# Altium project HeatPress.PrjPcb
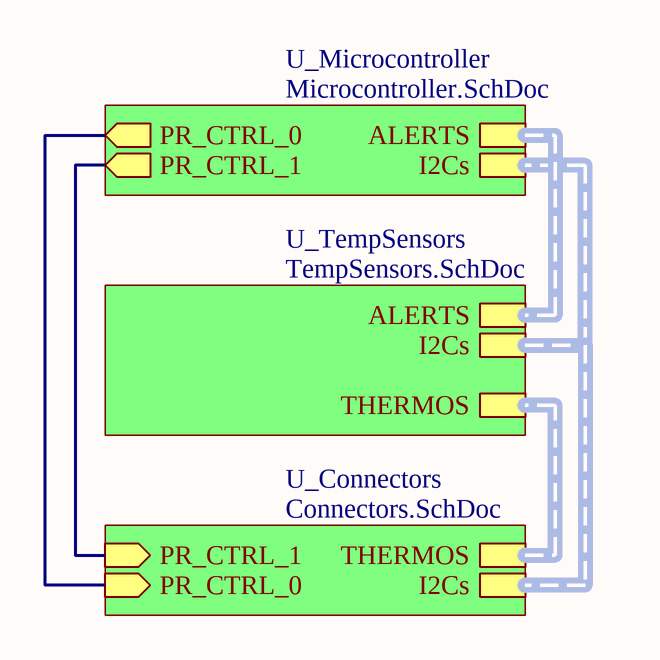
[diagram p0: MainBoard.SchDoc]
CAGE_CODE: ?????; CONTRACT_NUMBER: <CONTRACT NO>; DOC_NO_ASSY_DWG: <ASSY DWG NO>; DOC_NO_BOM: <BOM DOC NO>; DOC_NO_FAB_DWG: <FAB DWG NO>; DOC_NO_SCH_DWG: <SCH DWG NO>; PCB_2_DEC_TOL: +/-.01; PCB_3_DEC_TOL: +/-.010; PCB_ANG_TOL: +/-1/2; PCB_ASSEMBLY_NO: <PCB ASSY NO>; PCB_CHECKER: - -----; PCB_CHECKER_APP_DATE: --/--/----; PCB_DESIGNER: - -----; PCB_DESIGNER_APP_DATE: --/--/----; PCB_DWG_NO: <PCB DWG NO>; PCB_ENGINEER: - -----; PCB_ENGINEER_APP_DATE: --/--/----; PCB_PART_NUMBER: <PCB PN>; PCB_REV: A; SCH_REV: A
7 sheets, 147 parts. Net scope: hierarchical (ports join the sheet entries above them; power ports are global).
Board file: Main.PcbDoc
Sheets:
  MainBoard.SchDoc
    U_Microcontroller = Microcontroller.SchDoc
    U_TempSensors = TempSensors.SchDoc
      TS1 = TempSensor.SchDoc
      TS2 = TempSensor.SchDoc
      TS3 = TempSensor.SchDoc
      TS4 = TempSensor.SchDoc
    U_Connectors = Connectors.SchDoc
  HeatPlates.SchDoc
  Ext_Components.SchDoc

## Sheet MainBoard.SchDoc
size A; SheetNumber: 1; SheetTotal: 7

### Sub-sheets
U_Connectors = Connectors.SchDoc: THERMOS (harness THERMOS), PR_CTRL_0 (in), I2Cs (harness I2C_M), PR_CTRL_1 (in)
U_Microcontroller = Microcontroller.SchDoc: I2Cs (harness I2C_M), ALERTS (harness ALERT), PR_CTRL_0 (out), PR_CTRL_1 (out)
U_TempSensors = TempSensors.SchDoc: I2Cs (harness I2C_M), ALERTS (harness ALERT), THERMOS (harness ALERT)

### Nets
PR_CTRL_0: sheet U_Microcontroller/PR_CTRL_0, sheet U_Connectors/PR_CTRL_0
PR_CTRL_1: sheet U_Microcontroller/PR_CTRL_1, sheet U_Connectors/PR_CTRL_1

### Buses and harness runs
harness sheet U_Connectors/I2Cs = sheet U_Microcontroller/I2Cs = sheet U_TempSensors/I2Cs
harness sheet U_Connectors/THERMOS = sheet U_TempSensors/THERMOS
harness sheet U_Microcontroller/ALERTS = sheet U_TempSensors/ALERTS

## Sheet Microcontroller.SchDoc
size B; SheetNumber: 2; SheetTotal: 7
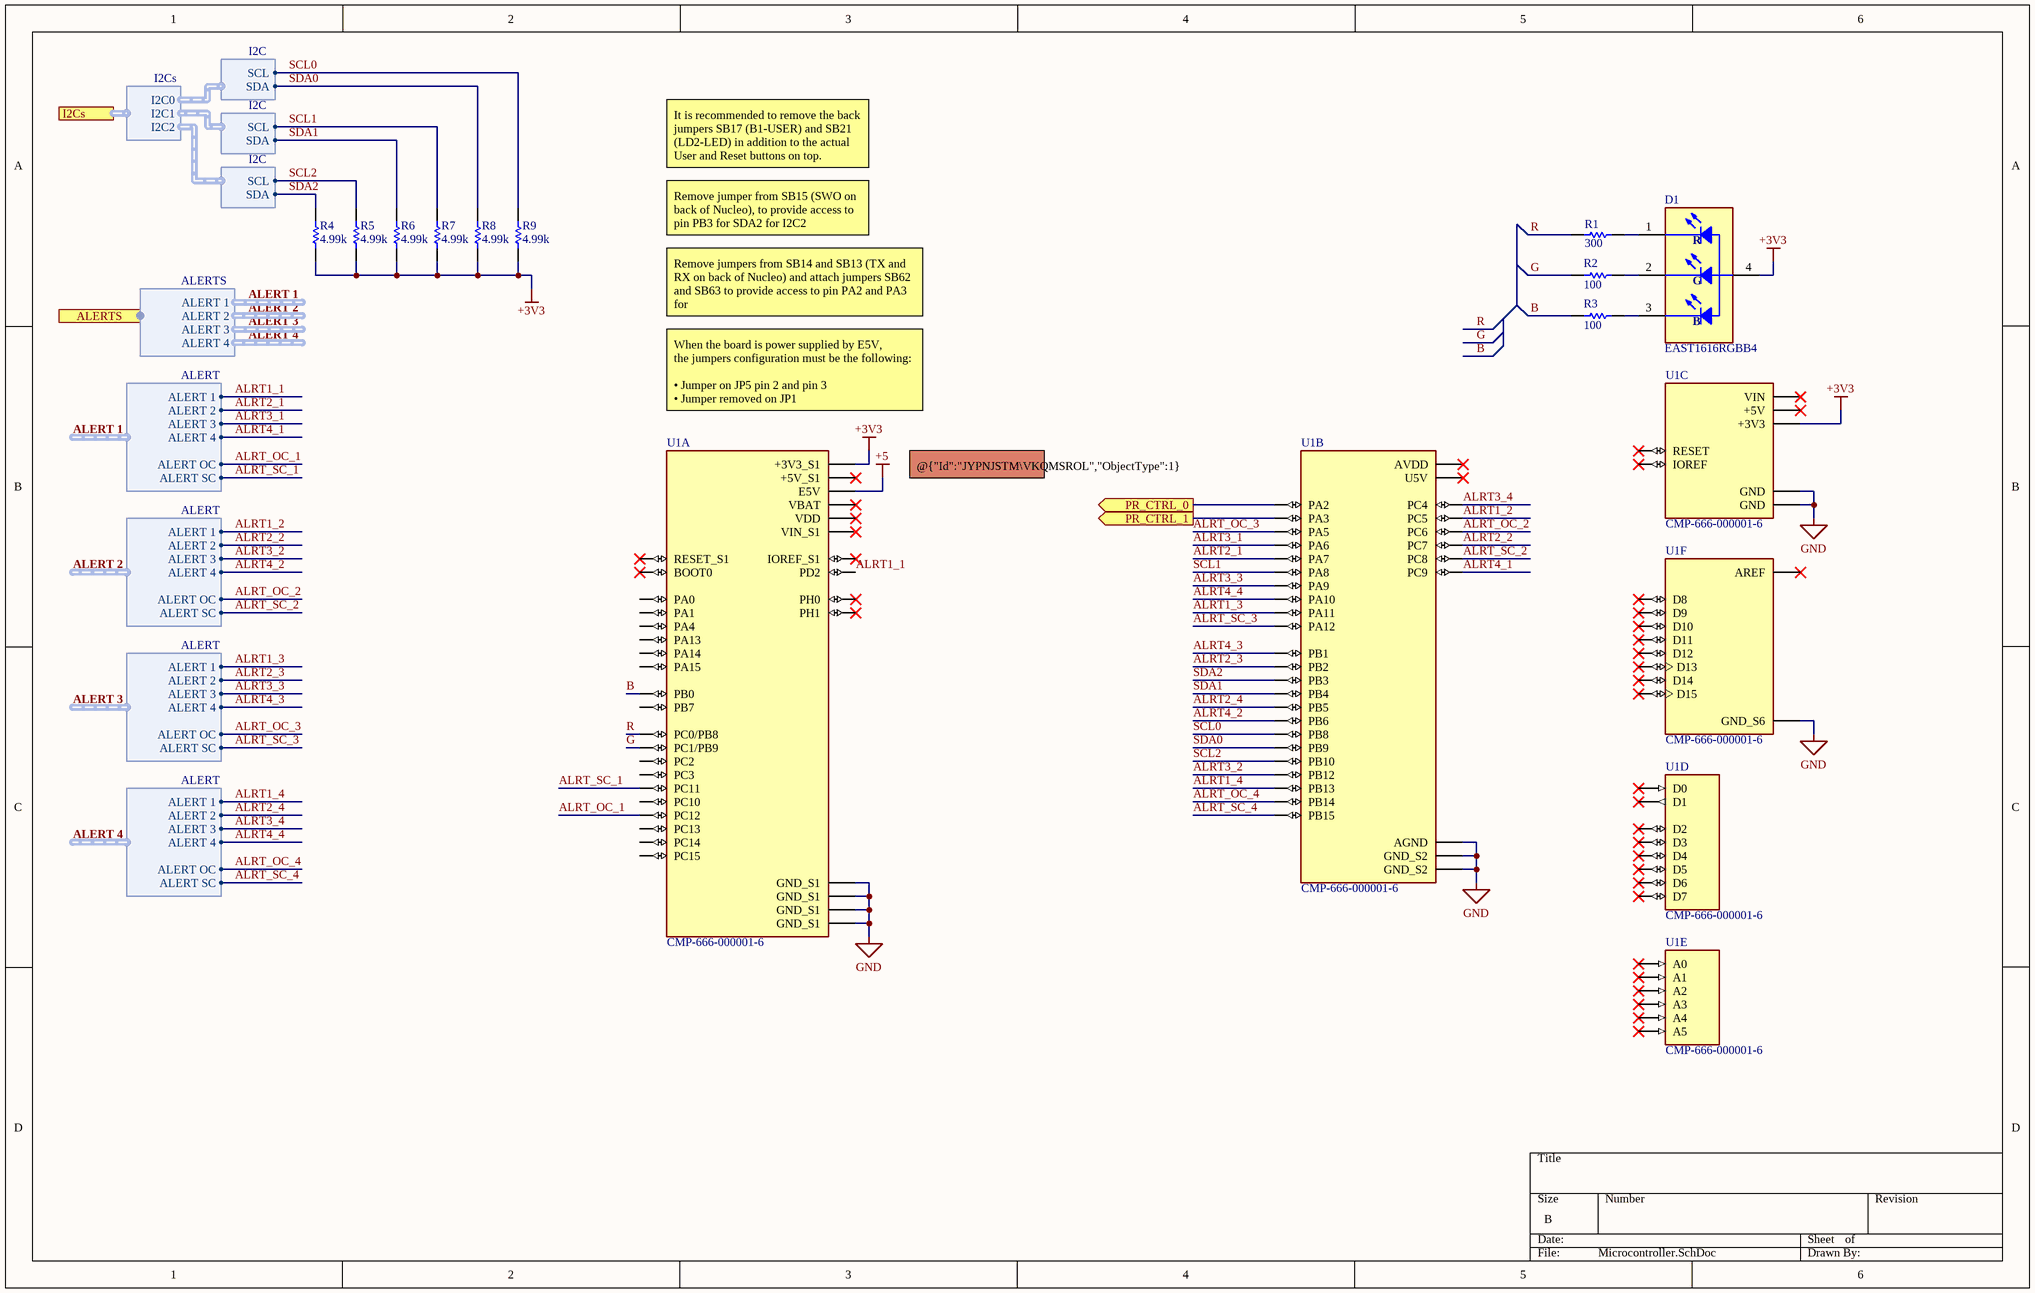
[diagram p1: Microcontroller.SchDoc]

### Parts
D1  EAST1616RGBB4  [FP-EAST1616RGBB4-MFG]
R1  value 300  [RES 0805_2012]  (hidden comment: ERJ-6ENF3000V)
R2  value 100  [RES 0805_2012]  (hidden comment: CRG0805F100R)
R3  value 100  [RES 0805_2012]  (hidden comment: CRG0805F100R)
R4  value 4.99k  [RES 0805_2012]  (hidden comment: ERJ-6ENF4991V)
R5  value 4.99k  [RES 0805_2012]  (hidden comment: ERJ-6ENF4991V)
R6  value 4.99k  [RES 0805_2012]  (hidden comment: ERJ-6ENF4991V)
R7  value 4.99k  [RES 0805_2012]  (hidden comment: ERJ-6ENF4991V)
R8  value 4.99k  [RES 0805_2012]  (hidden comment: ERJ-6ENF4991V)
R9  value 4.99k  [RES 0805_2012]  (hidden comment: ERJ-6ENF4991V)
U1  CMP-666-000001-6  [ST_NUCLEO-F401RE]  (parts A,B,C,D,E,F of 6)

### Ports
ALERTS (out, harness ALERTS), I2Cs (harness I2Cs), PR_CTRL_0 (out), PR_CTRL_1 (out)

### Harnesses
I2C: SDA, SCL
I2Cs: I2C1, I2C0, I2C2
ALERTS: ALERT 1, ALERT 2, ALERT 3, ALERT 4
ALERT: ALERT SC, ALERT OC, ALERT 1, ALERT 2, ALERT 3, ALERT 4

### Nets
+3V3: D1.4(COMMON_ANODE) R4.1 R5.1 R6.1 R7.1 R8.1 R9.1 U1.CN6_4(+3V3) U1.CN7_16(+3V3_S1)
+5: U1.CN7_6(E5V)
GND: U1.CN5_7(GND_S6) U1.CN6_6(GND) U1.CN6_7(GND) U1.CN7_8(GND_S1) U1.CN7_19(GND_S1) U1.CN7_20(GND_S1) U1.CN7_22(GND_S1) U1.CN10_9(GND_S2) U1.CN10_20(GND_S2) U1.CN10_32(AGND)
ALRT1_1: U1.CN7_4(PD2) ; harness ALERT.ALERT 1  [project net ALERT 1.ALERT 1]
ALRT1_2: U1.CN10_6(PC5) ; harness ALERT.ALERT 1  [project net ALERT 2.ALERT 1]
ALRT1_3: U1.CN10_14(PA11) ; harness ALERT.ALERT 1  [project net ALERT 3.ALERT 1]
ALRT1_4: U1.CN10_30(PB13) ; harness ALERT.ALERT 1  [project net ALERT 4.ALERT 1]
ALRT2_1: U1.CN10_15(PA7) ; harness ALERT.ALERT 2  [project net ALERT 1.ALERT 2]
ALRT2_2: U1.CN10_19(PC7) ; harness ALERT.ALERT 2  [project net ALERT 2.ALERT 2]
ALRT2_3: U1.CN10_22(PB2) ; harness ALERT.ALERT 2  [project net ALERT 3.ALERT 2]
ALRT2_4: U1.CN10_29(PB5) ; harness ALERT.ALERT 2  [project net ALERT 4.ALERT 2]
ALRT3_1: U1.CN10_13(PA6) ; harness ALERT.ALERT 3  [project net ALERT 1.ALERT 3]
ALRT3_2: U1.CN10_16(PB12) ; harness ALERT.ALERT 3  [project net ALERT 2.ALERT 3]
ALRT3_3: U1.CN10_21(PA9) ; harness ALERT.ALERT 3  [project net ALERT 3.ALERT 3]
ALRT3_4: U1.CN10_34(PC4) ; harness ALERT.ALERT 3  [project net ALERT 4.ALERT 3]
ALRT4_1: U1.CN10_1(PC9) ; harness ALERT.ALERT 4  [project net ALERT 1.ALERT 4]
ALRT4_2: U1.CN10_17(PB6) ; harness ALERT.ALERT 4  [project net ALERT 2.ALERT 4]
ALRT4_3: U1.CN10_24(PB1) ; harness ALERT.ALERT 4  [project net ALERT 3.ALERT 4]
ALRT4_4: U1.CN10_33(PA10) ; harness ALERT.ALERT 4  [project net ALERT 4.ALERT 4]
ALRT_OC_1: U1.CN7_3(PC12) ; harness ALERT.ALERT OC  [project net ALERT 1.ALERT OC]
ALRT_OC_2: U1.CN10_4(PC6) ; harness ALERT.ALERT OC  [project net ALERT 2.ALERT OC]
ALRT_OC_3: U1.CN10_11(PA5) ; harness ALERT.ALERT OC  [project net ALERT 3.ALERT OC]
ALRT_OC_4: U1.CN10_28(PB14) ; harness ALERT.ALERT OC  [project net ALERT 4.ALERT OC]
ALRT_SC_1: U1.CN7_2(PC11) ; harness ALERT.ALERT SC  [project net ALERT 1.ALERT SC]
ALRT_SC_2: U1.CN10_2(PC8) ; harness ALERT.ALERT SC  [project net ALERT 2.ALERT SC]
ALRT_SC_3: U1.CN10_12(PA12) ; harness ALERT.ALERT SC  [project net ALERT 3.ALERT SC]
ALRT_SC_4: U1.CN10_26(PB15) ; harness ALERT.ALERT SC  [project net ALERT 4.ALERT SC]
B: R3.1 U1.CN7_34(PB0)
G: R2.1 U1.CN7_36(PC1/PB9)
PR_CTRL_0: U1.CN10_35(PA2) ; port PR_CTRL_0
PR_CTRL_1: U1.CN10_37(PA3) ; port PR_CTRL_1
R: R1.1 U1.CN7_38(PC0/PB8)
SCL0: R9.2 U1.CN10_3(PB8) ; harness I2C.SCL
SCL1: R7.2 U1.CN10_23(PA8) ; harness I2C.SCL
SCL2: R5.2 U1.CN10_25(PB10) ; harness I2C.SCL
SDA0: R8.2 U1.CN10_5(PB9) ; harness I2C.SDA
SDA1: R6.2 U1.CN10_27(PB4) ; harness I2C.SDA
SDA2: R4.2 U1.CN10_31(PB3) ; harness I2C.SDA
NetD1_1: D1.1(RED_C) R1.2
NetD1_2: D1.2(GREEN_C) R2.2
NetD1_3: D1.3(BLUE_C) R3.2

Not connected (* = marked no-connect by the designer): U1 CN5_1(D8)* CN5_2(D9)* CN5_3(D10)* CN5_4(D11)* CN5_5(D12)* CN5_6(D13)* CN5_8(AREF)* CN5_9(D14)* CN5_10(D15)* CN6_2(IOREF)* CN6_3(RESET)* CN6_5(+5V)* CN6_8(VIN)* CN7_1(PC10) CN7_5(VDD)* CN7_7(BOOT0)* CN7_12(IOREF_S1)* CN7_13(PA13) CN7_14(RESET_S1)* CN7_15(PA14) CN7_17(PA15) CN7_18(+5V_S1)* CN7_21(PB7) CN7_23(PC13) CN7_24(VIN_S1)* CN7_25(PC14) CN7_27(PC15) CN7_28(PA0) CN7_29(PH0)* CN7_30(PA1) CN7_31(PH1)* CN7_32(PA4) CN7_33(VBAT)* CN7_35(PC2) CN7_37(PC3) CN8_1(A0)* CN8_2(A1)* CN8_3(A2)* CN8_4(A3)* CN8_5(A4)* CN8_6(A5)* CN9_1(D0)* CN9_2(D1)* CN9_3(D2)* CN9_4(D3)* CN9_5(D4)* CN9_6(D5)* CN9_7(D6)* CN9_8(D7)* CN10_7(AVDD)* CN10_8(U5V)*

### Notes on the sheet
- It is recommended to remove the back jumpers SB17 (B1-USER) and SB21 (LD2-LED) in addition to the actual User and Reset buttons on top.
- Remove jumper from SB15 (SWO on back of Nucleo), to provide access to pin PB3 for SDA2 for I2C2
- Remove jumpers from SB14 and SB13 (TX and RX on back of Nucleo) and attach jumpers SB62 and SB63 to provide access to pin PA2 and PA3 for @{"Id":"NLACXOFP\VKMUSWHO","ObjectType":1} and @{"Id":"NLACXOFP\SSHGJBFH","ObjectType":1}
- When the board is power supplied by E5V,
  the jumpers configuration must be the following:
  • Jumper on JP5 pin 2 and pin 3
  • Jumper removed on JP1
- @{"Id":"JYPNJSTM\VKQMSROL","ObjectType":1} 500mA MAX
- (in symbol CMP-007-00050-1) R; G; B

### Library data of the parts
D1 = CMP-007-00050-1: Triple Color LED; RoHS Compliant: Yes
R1 = CMP-009-00014-1: Fixed Resistor, Metal Glaze/thick Film, 0.125W, 300ohm, 150V, 1% +/-Tol, 100ppm/Cel, Surface Mount, 0805; Temperature Coefficient: 100ppm/°C; Power: 125mW; Package Height: 0.6mm; Package Length: 2mm; Package Width: 1.25mm; Rated Temperature: 70°C; Reference Standard: AEC-Q200; Tolerance: 1%; Max Operating Temperature: 155°C; Pins: 2; Reach SVHC Compliant: Yes; Packaging: Tape and Reel; RoHS Compliant: Yes; Case/Package: 0805; Termination: Wraparound; Resistor Type: FIXED RESISTOR; Construction: Rectangular; Mounting Technology: Surface Mount; Min Operating Temperature: -55°C; JESD-609 Code: e3; Package Shape: Rectangular; Package Style: SMTMeter; Technology: METAL GLAZE/THICK FILM; Terminal Finish: Nickel; Working Voltage: 150V
R2 R3 = CMP-009-00015-2: Fixed Resistor, Metal Glaze/thick Film, 0.125W, 100ohm, 150V, 1% +/-Tol, 200ppm/Cel, Surface Mount, 0805; Manufacturer Series: CRG; Manufacturer: TE Connectivity; Temperature Coefficient: 200ppm/°C; Additional Feature: LASER TRIMMABLE; MF: {'manufacturer': u'TE Connectivity'}; Rated Temperature: 70°C; Power: 125mW; Max Operating Temperature: 125°C; Design Item ID: CRG0805F100R; Working Voltage: 150V; Technology: METAL GLAZE/THICK FILM; Tolerance: 1%; Price: None; JESD-609 Code: e3; Mounting Technology: Surface Mount; MP: CRG0805F100R; Terminal Finish: Tin; RoHS Compliant: Yes; Case/Package: 0805; Availability: Unavailable; Pins: 2; Min Operating Temperature: -55°C; Source: CRG0805F100R.SchLib; Termination: Wraparound; Resistor Type: FIXED RESISTOR; Packaging: Tape and Reel; Package Shape: Rectangular; Component Type: Resistors; Manufacturer Part Number: CRG0805F100R
R4 R5 = CMP-009-00018-1: Fixed Resistor, Metal Glaze/thick Film, 0.125W, 4990ohm, 150V, 1% +/-Tol, 100ppm/Cel, Surface Mount, 0805; Package Width: 1.25mm; Rated Temperature: 70°C; Package Height: 0.6mm; Temperature Coefficient: 100ppm/°C; Reference Standard: AEC-Q200; Package Length: 2mm; Power: 125mW; Pins: 2; Termination: Wraparound; Package Style: SMTMeter; Working Voltage: 150V; Resistor Type: FIXED RESISTOR; Tolerance: 1%; Terminal Finish: Nickel; Packaging: Tape and Reel; Case/Package: 0805; Max Operating Temperature: 155°C; RoHS Compliant: Yes; Construction: Rectangular; Package Shape: Rectangular; Mounting Technology: Surface Mount; JESD-609 Code: e3; Reach SVHC Compliant: Yes; Min Operating Temperature: -55°C; Technology: METAL GLAZE/THICK FILM
R6-R9 = CMP-009-00018-1: Fixed Resistor, Metal Glaze/thick Film, 0.125W, 4990ohm, 150V, 1% +/-Tol, 100ppm/Cel, Surface Mount, 0805; Power: 125mW; Temperature Coefficient: 100ppm/°C; Package Length: 2mm; Package Width: 1.25mm; Rated Temperature: 70°C; Package Height: 0.6mm; Reference Standard: AEC-Q200; Tolerance: 1%; JESD-609 Code: e3; Resistor Type: FIXED RESISTOR; Construction: Rectangular; Case/Package: 0805; Reach SVHC Compliant: Yes; Max Operating Temperature: 155°C; Package Shape: Rectangular; RoHS Compliant: Yes; Packaging: Tape and Reel; Pins: 2; Package Style: SMTMeter; Min Operating Temperature: -55°C; Working Voltage: 150V; Termination: Wraparound; Technology: METAL GLAZE/THICK FILM; Mounting Technology: Surface Mount; Terminal Finish: Nickel
U1 = CMP-752-000003-2: STM32F401RE Embedded Nucleo STM32F4 MCU 32-Bit ARM Cortex-M3 Evaluation Board; MP: NUCLEO-F401RE; MF: STMicroelectronics; Design Item ID: NUCLEO-F401RE; Source: NUCLEO-F401RE.SchLib

## Sheet TempSensors.SchDoc
size A; SheetNumber: 3; SheetTotal: 7
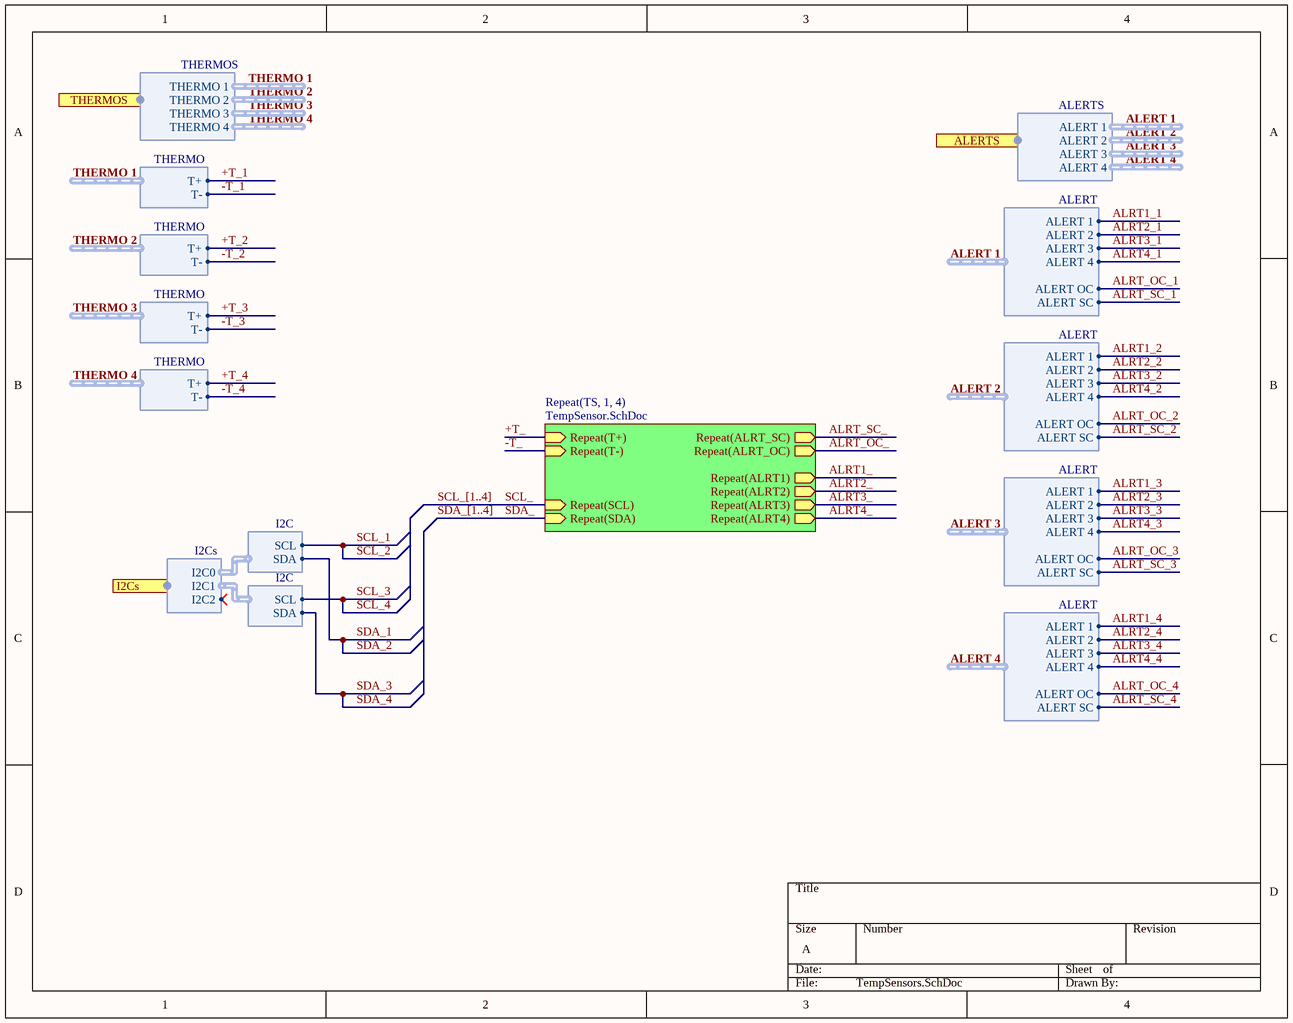
[diagram p2: TempSensors.SchDoc]

### Sub-sheets
Repeat(TS, 1, 4) = TempSensor.SchDoc: Repeat(T+) (in), Repeat(T-) (in), Repeat(ALRT_SC) (out), Repeat(ALRT_OC) (out), Repeat(ALRT1) (out), Repeat(ALRT2) (out), Repeat(ALRT3) (out), Repeat(ALRT4) (out), Repeat(SCL) (in), Repeat(SDA) (in)

### Ports
ALERTS (out, harness ALERTS), I2Cs (harness I2Cs), THERMOS (out, harness THERMOS)

### Harnesses
I2C: SDA, SCL
I2Cs: I2C1, I2C0, I2C2
ALERTS: ALERT 1, ALERT 2, ALERT 3, ALERT 4
ALERT: ALERT SC, ALERT OC, ALERT 1, ALERT 2, ALERT 3, ALERT 4
THERMOS: THERMO 1, THERMO 2, THERMO 3, THERMO 4
THERMO: T+, T-

### Buses and harness runs
bus SCL_[1..4]
bus SDA_[1..4]

## Sheet TempSensor.SchDoc
size A; SheetNumber: 4; SheetTotal: 7
Used 4 times, as channels U_TempSensors/TS1, U_TempSensors/TS2, U_TempSensors/TS3, U_TempSensors/TS4. Parts and nets are listed once, with the designators drawn on the sheet.
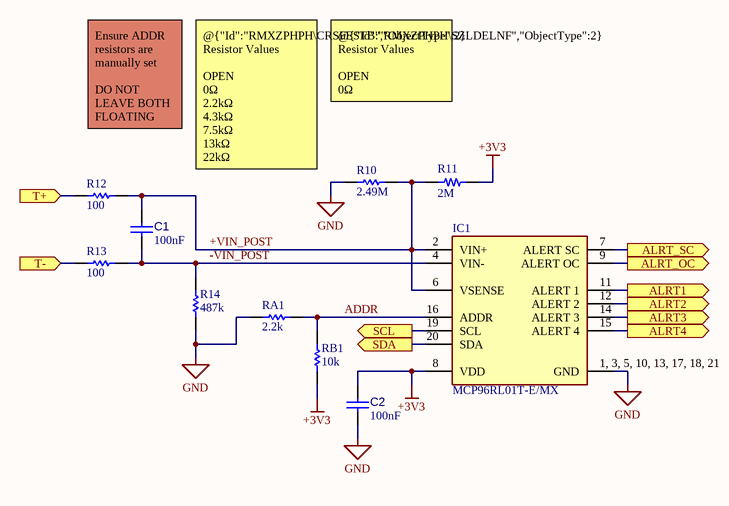
[diagram p3: TempSensor.SchDoc]

### Parts
C1  value 100nF  [CAP 0805_2012]  (hidden comment: CL21B104KBCNNNC)
C2  value 100nF  [CAP 0805_2012]  (hidden comment: CL21B104KBCNNNC)
IC1  MCP96RL01T-E/MX  [QFN65P500X500X100-21N-D]
R10  value 2.49M  [RES 0805_2012]  (hidden comment: CRCW08052M49FKEA)
R11  value 2M  [RES 0805_2012]  (hidden comment: CRCW08052M00FKECC)
R12  value 100  [RES 0805_2012]  (hidden comment: CRG0805F100R)
R13  value 100  [RES 0805_2012]  (hidden comment: CRG0805F100R)
R14  value 487k  [RES 0805_2012]  (hidden comment: ERJ-6ENF4873V)
RA1  value 2.2k  [RES 0805_2012]  (hidden comment: CRCW08052K20FKEAC)
RB1  value 10k  [RES 0805_2012]  (hidden comment: CRCW080510K0FKEAC)

### Ports
ALRT1 (out), ALRT2 (out), ALRT3 (out), ALRT4 (out), ALRT_OC (out), ALRT_SC (out), SCL (out), SDA (out), T+ (in), T- (in)

### Nets
+3V3: C2.1 IC1.8(VDD) R11.2 RB1.1
GND: C2.2 IC1.1,_3,_5,_10,_13,_17,_18,_21(GND) R10.1 R14.1 RA1.1
+VIN_POST: C1.2 IC1.2(VIN+) IC1.6(VSENSE) R10.2 R11.1 R12.2
-VIN_POST: C1.1 IC1.4(VIN-) R13.2 R14.2
ADDR: IC1.16(ADDR) RA1.2 RB1.2
ALRT1: IC1.11(ALERT_1) ; port ALRT1
ALRT2: IC1.12(ALERT_2) ; port ALRT2
ALRT3: IC1.14(ALERT_3) ; port ALRT3
ALRT4: IC1.15(ALERT_4) ; port ALRT4
ALRT_OC: IC1.9(ALERT_OC) ; port ALRT_OC
ALRT_SC: IC1.7(ALERT_SC) ; port ALRT_SC
SCL: IC1.19(SCL) ; port SCL
SDA: IC1.20(SDA) ; port SDA
T+: R12.1 ; port T+
T-: R13.1 ; port T-

### Channels
U_TempSensors/TS1: designators end in _TS1; ports ALRT1=ALERT 1.ALERT 1 ALRT2=ALERT 1.ALERT 2 ALRT3=ALERT 1.ALERT 3 ALRT4=ALERT 1.ALERT 4 ALRT_OC=ALERT 1.ALERT OC ALRT_SC=ALERT 1.ALERT SC SCL=SCL0 SDA=SDA0 T+=+T_1 T-=-T_1
U_TempSensors/TS2: designators end in _TS2; ports ALRT1=ALERT 2.ALERT 1 ALRT2=ALERT 2.ALERT 2 ALRT3=ALERT 2.ALERT 3 ALRT4=ALERT 2.ALERT 4 ALRT_OC=ALERT 2.ALERT OC ALRT_SC=ALERT 2.ALERT SC SCL=SCL0 SDA=SDA0 T+=+T_2 T-=-T_2
U_TempSensors/TS3: designators end in _TS3; ports ALRT1=ALERT 3.ALERT 1 ALRT2=ALERT 3.ALERT 2 ALRT3=ALERT 3.ALERT 3 ALRT4=ALERT 3.ALERT 4 ALRT_OC=ALERT 3.ALERT OC ALRT_SC=ALERT 3.ALERT SC SCL=SCL1 SDA=SDA1 T+=+T_3 T-=-T_3
U_TempSensors/TS4: designators end in _TS4; ports ALRT1=ALERT 4.ALERT 1 ALRT2=ALERT 4.ALERT 2 ALRT3=ALERT 4.ALERT 3 ALRT4=ALERT 4.ALERT 4 ALRT_OC=ALERT 4.ALERT OC ALRT_SC=ALERT 4.ALERT SC SCL=SCL1 SDA=SDA1 T+=+T_4 T-=-T_4

### Notes on the sheet
- Ensure ADDR resistors are manually set
  DO NOT LEAVE BOTH FLOATING
- @{"Id":"RMXZPHPH\SZLDELNF","ObjectType":2} Resistor Values
  OPEN
  0Ω
  10kΩ
- (near R10) @{"Id":"RMXZPHPH\CRSFESTB","ObjectType":2} Resistor Values
  OPEN
  0Ω
  2.2kΩ
  4.3kΩ
  7.5kΩ
  13kΩ
  22kΩ
  43kΩ

### Library data of the parts
C1 C2 = CMP-001-00134-5: Ceramic Capacitor, Multilayer, Ceramic, 50V, 10% +Tol, 10% -Tol, X7R, 15% TC, 0.1uF, Surface Mount, 0805; Multilayer: Yes; Mounting Technology: Surface Mount; RoHS Compliant: Yes; Pins: 2; Capacitor Type: Ceramic; Min Operating Temperature: -55°C; Max Operating Temperature: 125°C; Case/Package: 0805; Dielectric Material: Ceramic; Height: 0.95mm; JESD-609 Code: e3; Length: 2mm; Package Shape: Rectangular; Package Style: SMTMeter; Packaging: Tape and Reel; Rated DC Voltage (URdc): 50V; Reach SVHC Compliant: Yes; Temperature Characteristics Code: X7R; Terminal Finish: Nickel; Termination: Wraparound; Tolerance  (fill in as +-): 10%; Tolerance (fill in as +-): 10%; Width: 1.25mm
IC1 = CMP-031-00000-3: Fully integrated thermocouple Electromotive Force (EMF) to degrees Celsius converter IC with integrated thermocouple open-circuit and short-circuit detection and cold-junction compensation; Manufacturer_Name: Microchip; altium.hash: 88D551B438FC0B2CC4B3D3B3F597121D; Manufacturer_Part_Number: MCP96RL01T-E/MX; Mouser Price/Stock: https://www.mouser.com/Search/Refine.aspx?Keyword=579-MCP96RL01T-E%2FMX; Design Item ID: MCP96RL01T-E_MX; Source: SamacSys.SchLib; Datasheet Link: http://ww1.microchip.com/downloads/en/DeviceDoc/MCP960X-L0X-RL0X-Data-Sheet-20005426F.pdf; Mouser Part Number: 579-MCP96RL01T-E/MX; Height: 1mm
R10 = CMP-009-00019-1: Fixed Resistor, Metal Glaze/thick Film, 0.125W, 2490000ohm, 150V, 1% +/-Tol, 100ppm/Cel, Surface Mount, 0805; Package Height: 0.45mm; Power: 125mW; Reference Standard: AEC-Q200; Package Length: 2mm; Package Width: 1.25mm; Rated Temperature: 70°C; Temperature Coefficient: 100ppm/°C; Termination: Wraparound; Working Voltage: 150V; Pins: 2; Min Operating Temperature: -55°C; RoHS Compliant: Yes; Terminal Finish: Nickel; Package Style: SMTMeter; Resistor Type: FIXED RESISTOR; Technology: METAL GLAZE/THICK FILM; Package Shape: Rectangular; Max Operating Temperature: 155°C; Reach SVHC Compliant: Yes; Case/Package: 0805; Tolerance: 1%; Packaging: Tape and Reel; Mounting Technology: Surface Mount; JESD-609 Code: e3; Construction: Chip
R11 = CMP-009-00017-3: Fixed Resistor, Metal Glaze/thick Film, 0.125W, 2000000ohm, 150V, 1% +/-Tol, 100ppm/Cel, Surface Mount, 0805; Manufacturer: Vishay Dale; Package Height: 0.5mm; Power (Watts): 0.125W, 1/8W; Package Length: 2mm; Power: 125mW; Package Width: 1.25mm; Temperature Coefficient: -100100ppm/°C; ComponentLink1Description: Datasheet; Series: CRCW-C; Package / Case: 0805 (2012 Metric); Case/Package: 0805; Number of Terminations: 2; Size / Dimension: 0.079" L x 0.049" W (2.00mm x 1.25mm); ComponentLink1URL: http://www.vishay.com/docs/28773/crcwce3.pdf; Lifecycle Status: Active; Device Package: 0805 (2012 Metric); Pins: 2; RoHS Compliant: Yes; Supplier Device Package: 0805; ComponentLink2Description: DigiKey Link; Resistor Type: FIXED RESISTOR; LastUpdated: 9/18/2022 12:42:15 PM; Construction: Chip; JESD-609 Code: e3; Technology: METAL GLAZE/THICK FILM; Working Voltage: 150V; Package Style: SMTMeter; Part Number: CRCW08052M00FKECC; Height - Seated (Max): 0.024" (0.60mm); Terminal Finish: Nickel; Packaging: Tape and Reel; Price: 0.01; Composition: Thick Film; PartId: 30004; Reach SVHC Compliant: Yes; Part Status: Active; Operating Temperature: -55°C ~ 155°C; Min Operating Temperature: -55°C; Max Operating Temperature: 155°C; Tolerance: 1%; ComponentLink2URL: https://www.digikey.com/en/products/detail/vishay-dale/CRCW08052M00FKECC/7928551; Minimum Order: 1; Component Type: Resistors; Design Item ID: CMP-309-001138-4; Manufacturer Part Number: CRCW08052M00FKECC; Source: HeatPress.SCHLIB
R12 R13 = CMP-009-00015-2: as R2 on sheet Microcontroller; Max Operating Temperature: 125°C; Design Item ID: CRG0805F100R; Working Voltage: 150V; Technology: METAL GLAZE/THICK FILM; Tolerance: 1%; Price: None; JESD-609 Code: e3; Mounting Technology: Surface Mount; MP: CRG0805F100R; Terminal Finish: Tin; RoHS Compliant: Yes; Case/Package: 0805; Availability: Unavailable; Pins: 2; Min Operating Temperature: -55°C; Source: CRG0805F100R.SchLib; Termination: Wraparound; Resistor Type: FIXED RESISTOR; Packaging: Tape and Reel; Package Shape: Rectangular; Component Type: Resistors; Manufacturer Part Number: CRG0805F100R
R14 = CMP-009-00021-1: Fixed Resistor, Metal Glaze/thick Film, 0.125W, 487000ohm, 150V, 1% +/-Tol, 100ppm/Cel, Surface Mount, 0805; Package Length: 2mm; Power: 125mW; Temperature Coefficient: 100ppm/°C; Package Height: 0.6mm; Reference Standard: AEC-Q200; Package Width: 1.25mm; Rated Temperature: 70°C; Min Operating Temperature: -55°C; Mounting Technology: Surface Mount; Package Shape: Rectangular; Technology: METAL GLAZE/THICK FILM; Case/Package: 0805; Package Style: SMTMeter; Termination: Wraparound; Reach SVHC Compliant: Yes; Pins: 2; Working Voltage: 150V; Max Operating Temperature: 155°C; Tolerance: 1%; RoHS Compliant: Yes; JESD-609 Code: e3; Packaging: Tape and Reel; Terminal Finish: Nickel; Construction: Rectangular; Resistor Type: FIXED RESISTOR
RA1 = CMP-009-00025-2: Fixed Resistor, Metal Glaze/thick Film, 0.125W, 2200ohm, 150V, 1% +/-Tol, 100ppm/Cel, Surface Mount, 0805; Package Width: 1.25mm; Package Length: 2mm; Power: 125mW; Package Height: 0.5mm; Rated Temperature: 70°C; Reference Standard: AEC-Q200; Temperature Coefficient: -100100ppm/°C; Reach SVHC Compliant: Yes; Max Operating Temperature: 155°C; Mounting Technology: Surface Mount; JESD-609 Code: e3; Package Style: SMTMeter; Pins: 2; Resistor Type: FIXED RESISTOR; Working Voltage: 150V; RoHS Compliant: Yes; Case/Package: 0805; Packaging: Tape and Reel; Terminal Finish: Nickel; Min Operating Temperature: -55°C; Technology: METAL GLAZE/THICK FILM; Construction: Chip; Termination: Wraparound; Tolerance: 1%; Package Shape: Rectangular
RB1 = CMP-009-00022-1: Fixed Resistor, Metal Glaze/thick Film, 0.125W, 10000ohm, 150V, 1% +/-Tol, 100ppm/Cel, Surface Mount, 0805; Package Width: 1.25mm; Temperature Coefficient: -100100ppm/°C; Power: 125mW; Package Height: 0.5mm; Package Length: 2mm; Min Operating Temperature: -55°C; Resistor Type: FIXED RESISTOR; Package Style: SMTMeter; Tolerance: 1%; RoHS Compliant: Yes; Construction: Chip; Reach SVHC Compliant: Yes; Pins: 2; Packaging: Tape and Reel; Max Operating Temperature: 155°C; Technology: METAL GLAZE/THICK FILM; Case/Package: 0805; JESD-609 Code: e3; Working Voltage: 150V; Terminal Finish: Nickel

## Sheet Connectors.SchDoc
size A; SheetNumber: 5; SheetTotal: 7
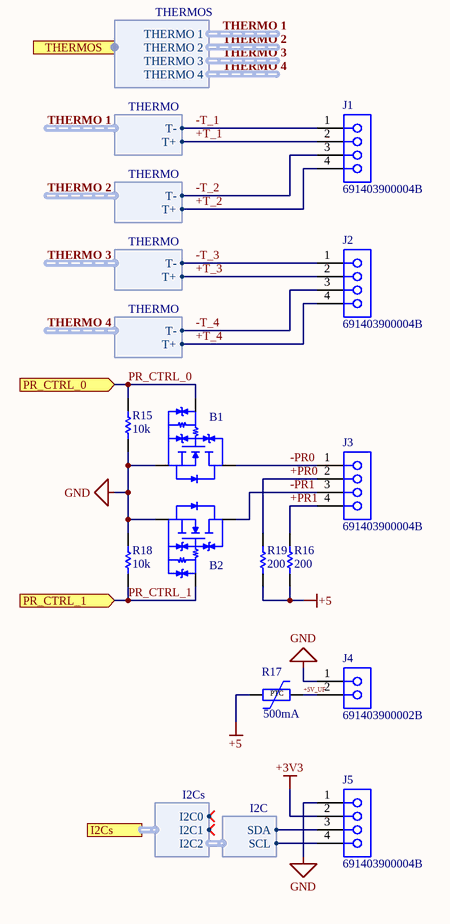
[diagram p4: Connectors.SchDoc]

### Parts
B1  CMP-532-000000-3  [SOTFL95P240X88-3N]  (value not drawn)
B2  CMP-532-000000-3  [SOTFL95P240X88-3N]  (value not drawn)
J1  691403900004B  [691403900004B]
J2  691403900004B  [691403900004B]
J3  691403900004B  [691403900004B]
J4  691403900002B  [691403900002B]
J5  691403900004B  [691403900004B]
R15  value 10k  [RES 0805_2012]  (hidden comment: CRCW080510K0FKEAC)
R16  value 200  [RES 1206_3216]  (hidden comment: ERA-8AEB201V)
R17  CMP-009-00302-6  [RESC3216X125N]  (value not drawn)
R18  value 10k  [RES 0805_2012]  (hidden comment: CRCW080510K0FKEAC)
R19  value 200  [RES 1206_3216]  (hidden comment: ERA-8AEB201V)

### Ports
I2Cs (harness I2Cs), PR_CTRL_0 (in), PR_CTRL_1 (in), THERMOS (out, harness THERMOS)

### Harnesses
THERMOS: THERMO 1, THERMO 2, THERMO 3, THERMO 4
THERMO: T+, T-
I2C: SDA, SCL
I2Cs: I2C1, I2C0, I2C2

### Nets
+3V3: J5.2
+5: R16.1 R17.1 R19.1
GND: B1.2(S) B2.2(S) J4.1 J5.1 R15.1 R18.2
+5V_UF: J4.2 R17.2
+PR0: J3.2 R19.2
+PR1: J3.4 R16.2
+T_1: J1.2 ; harness THERMO.T+
+T_2: J1.4 ; harness THERMO.T+
+T_3: J2.2 ; harness THERMO.T+
+T_4: J2.4 ; harness THERMO.T+
-PR0: B1.3(D) J3.1
-PR1: B2.3(D) J3.3
-T_1: J1.1 ; harness THERMO.T-
-T_2: J1.3 ; harness THERMO.T-
-T_3: J2.1 ; harness THERMO.T-
-T_4: J2.3 ; harness THERMO.T-
PR_CTRL_0: B1.1(G) R15.2 ; port PR_CTRL_0
PR_CTRL_1: B2.1(G) R18.1 ; port PR_CTRL_1
SCL2: J5.4 ; harness I2C.SCL
SDA2: J5.3 ; harness I2C.SDA

### Notes on the sheet
- (in symbol CMP-009-00016-3) PTC

### Library data of the parts
B1 B2 = CMP-752-000002-2: Trans MOSFET N-CH Si 60V 0.65A Automotive 3-Pin SOT-23F T/R; Source: SSM3K357R,LF.SchLib; Design Item ID: SSM3K357R,LF
J1-J3 J5 = CMP-752-000001-2: Barrier Strip Terminal Block; Manufacturer Series: 4039B; Terminal and Terminal Block Type: BARRIER STRIP TERMINAL BLOCK; RoHS Compliant: Yes; Reach SVHC Compliant: Yes; Design Item ID: CMP-002-00140-1; Source: HeatPress.SCHLIB
J4 = CMP-752-000000-2: Barrier Strip Terminal Block; Manufacturer Series: 4039B; Terminal and Terminal Block Type: BARRIER STRIP TERMINAL BLOCK; Reach SVHC Compliant: Yes; RoHS Compliant: Yes; Design Item ID: CMP-002-00139-1; Source: HeatPress.SCHLIB
R15 R18 = CMP-009-00022-1: as RB1 on sheet TempSensor; Min Operating Temperature: -55°C; Resistor Type: FIXED RESISTOR; Package Style: SMTMeter; Tolerance: 1%; RoHS Compliant: Yes; Construction: Chip; Reach SVHC Compliant: Yes; Pins: 2; Packaging: Tape and Reel; Max Operating Temperature: 155°C; Technology: METAL GLAZE/THICK FILM; Case/Package: 0805; JESD-609 Code: e3; Working Voltage: 150V; Terminal Finish: Nickel
R16 R19 = CMP-009-00023-1: Res Thin Film 1206 200 Ohm 0.1% 1/4W ±25ppm/°C Molded SMD SMD Punched Carrier T/R; Package Height: 0.6mm; Rated Temperature: 85°C; Working Voltage: 150V; Reference Standard: AEC-Q200; Package Length: 3.2mm; Power: 250mW; Package Width: 1.6mm; Max Operating Temperature: 155°C; Mounting Technology: Surface Mount; Temperature Coefficient: 25ppm/°C; Min Operating Temperature: -55°C; Termination: Wraparound; Tolerance: 0.1%; RoHS Compliant: Yes; Reach SVHC Compliant: Yes; Resistor Type: FIXED RESISTOR; Technology: THIN FILM; Case/Package: 1206; Construction: Rectangular; Package Style: SMTMeter; Terminal Finish: Nickel; JESD-609 Code: e3; Pins: 2; Packaging: Tape and Reel
R17 = CMP-009-00016-3: PTC Resettable Fuse, 24V, 0.15ohm, Surface Mount; Package Length: 3.5mm; MP: 0ZCJ0050AF2E; MF: {'manufacturer': u'Bel Fuse'}; Current Rating: 500mA; Value: 0.75; Package Width: 1.8mm; Package Height: 1.2mm; Reference Standard: UL; Price: None; Reach SVHC Compliant: Yes; JESD-609 Code: e3; RoHS Compliant: Yes; Resistor Type: PTC THERMISTOR; Availability: Unavailable; Working Voltage: 24V; Max Operating Temperature: 85°C; Design Item ID: 0ZCJ0050AF2E; Source: 0ZCJ0050AF2E.SchLib; Terminal Finish: Tin; Case/Package: None; Min Operating Temperature: -40°C

## Sheet HeatPlates.SchDoc
size B; SheetNumber: 6; SheetTotal: 7
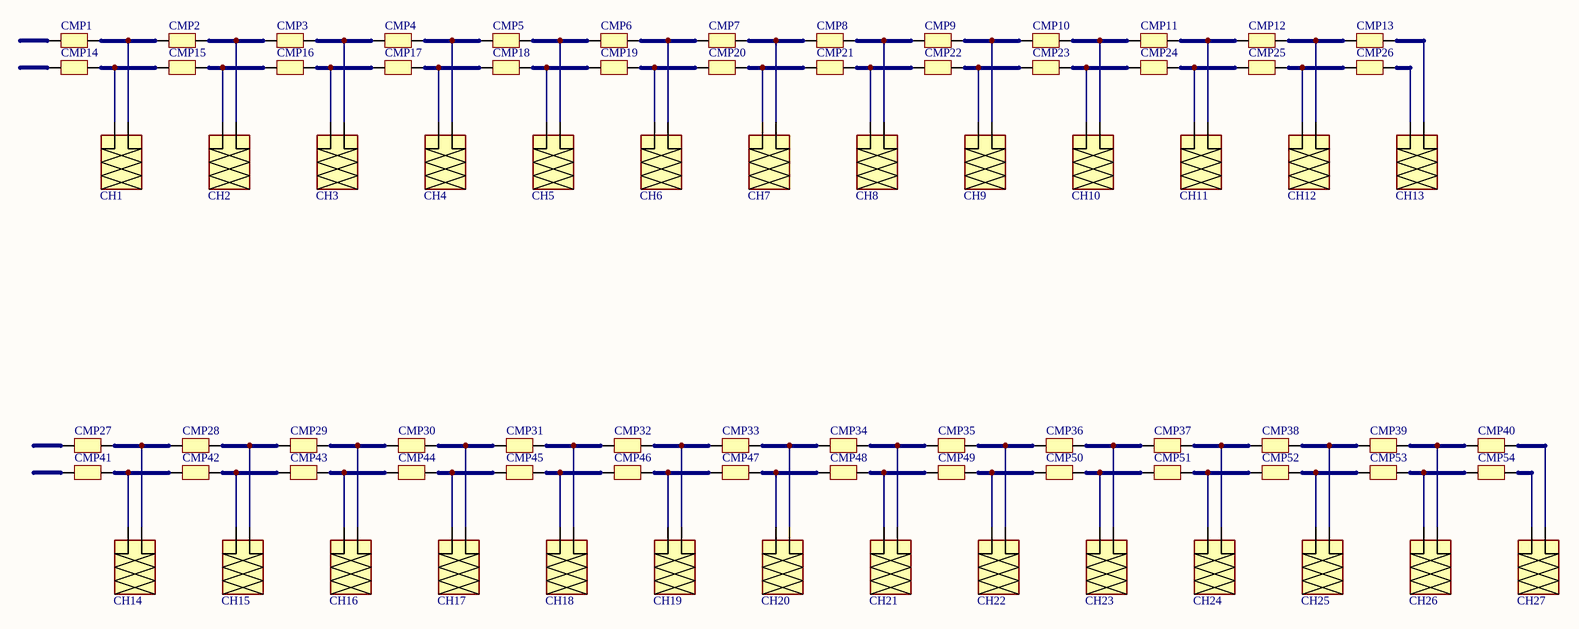
[diagram p5: HeatPlates.SchDoc]

### Parts
CH1  GCH  [Generic Cartridge Heater-Footprint-1]  (value not drawn)
CH2  GCH  [Generic Cartridge Heater-Footprint-1]  (value not drawn)
CH3  GCH  [Generic Cartridge Heater-Footprint-1]  (value not drawn)
CH4  GCH  [Generic Cartridge Heater-Footprint-1]  (value not drawn)
CH5  GCH  [Generic Cartridge Heater-Footprint-1]  (value not drawn)
CH6  GCH  [Generic Cartridge Heater-Footprint-1]  (value not drawn)
CH7  GCH  [Generic Cartridge Heater-Footprint-1]  (value not drawn)
CH8  GCH  [Generic Cartridge Heater-Footprint-1]  (value not drawn)
CH9  GCH  [Generic Cartridge Heater-Footprint-1]  (value not drawn)
CH10  GCH  [Generic Cartridge Heater-Footprint-1]  (value not drawn)
CH11  GCH  [Generic Cartridge Heater-Footprint-1]  (value not drawn)
CH12  GCH  [Generic Cartridge Heater-Footprint-1]  (value not drawn)
CH13  GCH  [Generic Cartridge Heater-Footprint-1]  (value not drawn)
CH14  GCH  [Generic Cartridge Heater-Footprint-1]  (value not drawn)
CH15  GCH  [Generic Cartridge Heater-Footprint-1]  (value not drawn)
CH16  GCH  [Generic Cartridge Heater-Footprint-1]  (value not drawn)
CH17  GCH  [Generic Cartridge Heater-Footprint-1]  (value not drawn)
CH18  GCH  [Generic Cartridge Heater-Footprint-1]  (value not drawn)
CH19  GCH  [Generic Cartridge Heater-Footprint-1]  (value not drawn)
CH20  GCH  [Generic Cartridge Heater-Footprint-1]  (value not drawn)
CH21  GCH  [Generic Cartridge Heater-Footprint-1]  (value not drawn)
CH22  GCH  [Generic Cartridge Heater-Footprint-1]  (value not drawn)
CH23  GCH  [Generic Cartridge Heater-Footprint-1]  (value not drawn)
CH24  GCH  [Generic Cartridge Heater-Footprint-1]  (value not drawn)
CH25  GCH  [Generic Cartridge Heater-Footprint-1]  (value not drawn)
CH26  GCH  [Generic Cartridge Heater-Footprint-1]  (value not drawn)
CH27  GCH  [Generic Cartridge Heater-Footprint-1]  (value not drawn)
CMP1  0192020054  [0192020054-Footprint-1]  (value not drawn)
CMP2  0192020054  [0192020054-Footprint-1]  (value not drawn)
CMP3  0192020054  [0192020054-Footprint-1]  (value not drawn)
CMP4  0192020054  [0192020054-Footprint-1]  (value not drawn)
CMP5  0192020054  [0192020054-Footprint-1]  (value not drawn)
CMP6  0192020054  [0192020054-Footprint-1]  (value not drawn)
CMP7  0192020054  [0192020054-Footprint-1]  (value not drawn)
CMP8  0192020054  [0192020054-Footprint-1]  (value not drawn)
CMP9  0192020054  [0192020054-Footprint-1]  (value not drawn)
CMP10  0192020054  [0192020054-Footprint-1]  (value not drawn)
CMP11  0192020054  [0192020054-Footprint-1]  (value not drawn)
CMP12  0192020054  [0192020054-Footprint-1]  (value not drawn)
CMP13  0192020054  [0192020054-Footprint-1]  (value not drawn)
CMP14  0192020054  [0192020054-Footprint-1]  (value not drawn)
CMP15  0192020054  [0192020054-Footprint-1]  (value not drawn)
CMP16  0192020054  [0192020054-Footprint-1]  (value not drawn)
CMP17  0192020054  [0192020054-Footprint-1]  (value not drawn)
CMP18  0192020054  [0192020054-Footprint-1]  (value not drawn)
CMP19  0192020054  [0192020054-Footprint-1]  (value not drawn)
CMP20  0192020054  [0192020054-Footprint-1]  (value not drawn)
CMP21  0192020054  [0192020054-Footprint-1]  (value not drawn)
CMP22  0192020054  [0192020054-Footprint-1]  (value not drawn)
CMP23  0192020054  [0192020054-Footprint-1]  (value not drawn)
CMP24  0192020054  [0192020054-Footprint-1]  (value not drawn)
CMP25  0192020054  [0192020054-Footprint-1]  (value not drawn)
CMP26  0192020054  [0192020054-Footprint-1]  (value not drawn)
CMP27  0192020054  [0192020054-Footprint-1]  (value not drawn)
CMP28  0192020054  [0192020054-Footprint-1]  (value not drawn)
CMP29  0192020054  [0192020054-Footprint-1]  (value not drawn)
CMP30  0192020054  [0192020054-Footprint-1]  (value not drawn)
CMP31  0192020054  [0192020054-Footprint-1]  (value not drawn)
CMP32  0192020054  [0192020054-Footprint-1]  (value not drawn)
CMP33  0192020054  [0192020054-Footprint-1]  (value not drawn)
CMP34  0192020054  [0192020054-Footprint-1]  (value not drawn)
CMP35  0192020054  [0192020054-Footprint-1]  (value not drawn)
CMP36  0192020054  [0192020054-Footprint-1]  (value not drawn)
CMP37  0192020054  [0192020054-Footprint-1]  (value not drawn)
CMP38  0192020054  [0192020054-Footprint-1]  (value not drawn)
CMP39  0192020054  [0192020054-Footprint-1]  (value not drawn)
CMP40  0192020054  [0192020054-Footprint-1]  (value not drawn)
CMP41  0192020054  [0192020054-Footprint-1]  (value not drawn)
CMP42  0192020054  [0192020054-Footprint-1]  (value not drawn)
CMP43  0192020054  [0192020054-Footprint-1]  (value not drawn)
CMP44  0192020054  [0192020054-Footprint-1]  (value not drawn)
CMP45  0192020054  [0192020054-Footprint-1]  (value not drawn)
CMP46  0192020054  [0192020054-Footprint-1]  (value not drawn)
CMP47  0192020054  [0192020054-Footprint-1]  (value not drawn)
CMP48  0192020054  [0192020054-Footprint-1]  (value not drawn)
CMP49  0192020054  [0192020054-Footprint-1]  (value not drawn)
CMP50  0192020054  [0192020054-Footprint-1]  (value not drawn)
CMP51  0192020054  [0192020054-Footprint-1]  (value not drawn)
CMP52  0192020054  [0192020054-Footprint-1]  (value not drawn)
CMP53  0192020054  [0192020054-Footprint-1]  (value not drawn)
CMP54  0192020054  [0192020054-Footprint-1]  (value not drawn)

### Nets
NetCH1_0: CH1.0 CMP14.1 CMP15.0
NetCH1_1: CH1.1 CMP1.1 CMP2.0
NetCH2_0: CH2.0 CMP15.1 CMP16.0
NetCH2_1: CH2.1 CMP2.1 CMP3.0
NetCH3_0: CH3.0 CMP16.1 CMP17.0
NetCH3_1: CH3.1 CMP3.1 CMP4.0
NetCH4_0: CH4.0 CMP17.1 CMP18.0
NetCH4_1: CH4.1 CMP4.1 CMP5.0
NetCH5_0: CH5.0 CMP18.1 CMP19.0
NetCH5_1: CH5.1 CMP5.1 CMP6.0
NetCH6_0: CH6.0 CMP19.1 CMP20.0
NetCH6_1: CH6.1 CMP6.1 CMP7.0
NetCH7_0: CH7.0 CMP20.1 CMP21.0
NetCH7_1: CH7.1 CMP7.1 CMP8.0
NetCH8_0: CH8.0 CMP21.1 CMP22.0
NetCH8_1: CH8.1 CMP8.1 CMP9.0
NetCH9_0: CH9.0 CMP22.1 CMP23.0
NetCH9_1: CH9.1 CMP9.1 CMP10.0
NetCH10_0: CH10.0 CMP23.1 CMP24.0
NetCH10_1: CH10.1 CMP10.1 CMP11.0
NetCH11_0: CH11.0 CMP24.1 CMP25.0
NetCH11_1: CH11.1 CMP11.1 CMP12.0
NetCH12_0: CH12.0 CMP25.1 CMP26.0
NetCH12_1: CH12.1 CMP12.1 CMP13.0
NetCH13_0: CH13.0 CMP26.1
NetCH13_1: CH13.1 CMP13.1
NetCH14_0: CH14.0 CMP41.1 CMP42.0
NetCH14_1: CH14.1 CMP27.1 CMP28.0
NetCH15_0: CH15.0 CMP42.1 CMP43.0
NetCH15_1: CH15.1 CMP28.1 CMP29.0
NetCH16_0: CH16.0 CMP43.1 CMP44.0
NetCH16_1: CH16.1 CMP29.1 CMP30.0
NetCH17_0: CH17.0 CMP44.1 CMP45.0
NetCH17_1: CH17.1 CMP30.1 CMP31.0
NetCH18_0: CH18.0 CMP45.1 CMP46.0
NetCH18_1: CH18.1 CMP31.1 CMP32.0
NetCH19_0: CH19.0 CMP46.1 CMP47.0
NetCH19_1: CH19.1 CMP32.1 CMP33.0
NetCH20_0: CH20.0 CMP47.1 CMP48.0
NetCH20_1: CH20.1 CMP33.1 CMP34.0
NetCH21_0: CH21.0 CMP48.1 CMP49.0
NetCH21_1: CH21.1 CMP34.1 CMP35.0
NetCH22_0: CH22.0 CMP49.1 CMP50.0
NetCH22_1: CH22.1 CMP35.1 CMP36.0
NetCH23_0: CH23.0 CMP50.1 CMP51.0
NetCH23_1: CH23.1 CMP36.1 CMP37.0
NetCH24_0: CH24.0 CMP51.1 CMP52.0
NetCH24_1: CH24.1 CMP37.1 CMP38.0
NetCH25_0: CH25.0 CMP52.1 CMP53.0
NetCH25_1: CH25.1 CMP38.1 CMP39.0
NetCH26_0: CH26.0 CMP53.1 CMP54.0
NetCH26_1: CH26.1 CMP39.1 CMP40.0
NetCH27_0: CH27.0 CMP54.1
NetCH27_1: CH27.1 CMP40.1

Not connected (* = marked no-connect by the designer): CMP1 0; CMP14 0; CMP27 0; CMP41 0

### Library data of the parts
CH1-CH27 = CMP-00030-00013-5: Generic cartridge heater; Pins: 2
CMP1-CMP54 = CMP-002-00129-2: Wire Terminal, 10.5mm2. Terminal Butt Splice, Inline, Individual Openings Connector Crimp 8 AWG Red; Manufacturer Series: 19202; Reach SVHC Compliant: Yes; RoHS Compliant: Yes; Terminal and Terminal Block Type: WIRE TERMINAL

## Sheet Ext_Components.SchDoc
size A; SheetNumber: 7; SheetTotal: 7
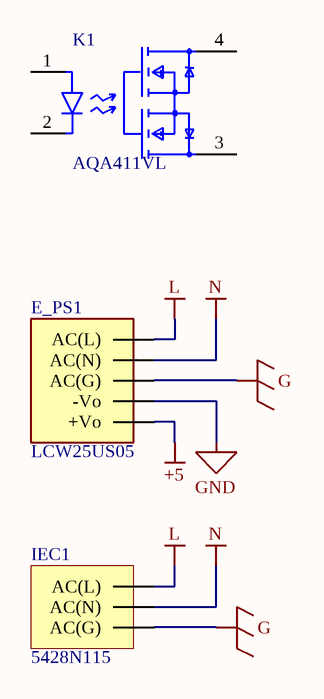
[diagram p6: Ext_Components.SchDoc]

### Parts
E_PS1  LCW25US05  [LCW25US12-Footprint-1]  (mechanical)
IEC1  5428N115  [5428N115-Footprint-1]  (mechanical)
K1  AQA411VL  [AQA411VL-Footprint-1]

### Nets
+5: E_PS1.4(+Vo)
G: E_PS1.2(AC(G)) IEC1.2(AC(G))
GND: E_PS1.3(-Vo)
L: E_PS1.0(AC(L)) IEC1.0(AC(L))
N: E_PS1.1(AC(N)) IEC1.1(AC(N))

Not connected (* = marked no-connect by the designer): K1 1(A) 2(C) 3(1_DRAIN) 4(2_DRAIN)

### Library data of the parts
E_PS1 = CMP-019-00070-2: Power Supply, AC-DC, Enclosed, Industrial, 25W, 5V, LCW25 Series
IEC1 = CMP-002-00128-4: IEC Connector with Power Switch Screw on, C20, 20A UL, DPST-NO; Voltage Rating: 250V; Connector Type: C20; Max Current Rating: 20A; Pins: 3; ComponentLink1Description: Part Link; ComponentLink1URL: https://www.mcmaster.com/5428N115/
K1 = CMP-00026-00010-1: Relay Ssr 50MA 1.5V Dc-in 0.25A 40V Ac/dc-out 4-PIN SSOP T/r; Input Type: DC; Max Power Dissipation: 300mW; On-State Resistance: 1.25R; Isolation Voltage-Max: 1.5kV; Load Current: 250mA; Forward Current: 900uA; Throw Configuration: SPST; Lead Free: Lead Free; Max Operating Temperature: 85°C; Number of Pins: 4; Max Input Voltage: 1.5V; Max Input Current: 50mA; Series: PhotoMOS™ AQY; Output Voltage: 40V; Isolation Voltage: 1.5kV; Height: 1.8mm; Width: 2.65mm; Radiation Hardening: No; Packaging: Tape and Reel; Length: 4.45mm; Max Output Voltage: 40V; Mount: Surface Mount; Relay Type: Relay; RoHS Compliant: Yes; On-state Resistance-Max: 1.25R; Min Operating Temperature: -40°C; Output Current: 250mA; Input Current: 50mA; Case/Package: SSOP; Package Quantity: 1; Reach SVHC Compliant: Yes; Max Output Current: 250mA; Termination: SMD/SMT

## Nets that join several sheets
+3V3: Microcontroller (9 pins), U_TempSensors/TS1 (C2_TS1.1 IC1_TS1.8 R11_TS1.2 RB1_TS1.1), U_TempSensors/TS2 (C2_TS2.1 IC1_TS2.8 R11_TS2.2 RB1_TS2.1), U_TempSensors/TS3 (C2_TS3.1 IC1_TS3.8 R11_TS3.2 RB1_TS3.1), U_TempSensors/TS4 (C2_TS4.1 IC1_TS4.8 R11_TS4.2 RB1_TS4.1), Connectors (J5.2)
+5: Microcontroller (U1.CN7_6), Connectors (R16.1 R17.1 R19.1), Ext_Components (E_PS1.4)
GND: Microcontroller (10 pins), U_TempSensors/TS1 (5 pins), U_TempSensors/TS2 (5 pins), U_TempSensors/TS3 (5 pins), U_TempSensors/TS4 (5 pins), Connectors (6 pins), Ext_Components (E_PS1.3)
+T_1: U_TempSensors/TS1 (R12_TS1.1), Connectors (J1.2)
+T_2: U_TempSensors/TS2 (R12_TS2.1), Connectors (J1.4)
+T_3: U_TempSensors/TS3 (R12_TS3.1), Connectors (J2.2)
+T_4: U_TempSensors/TS4 (R12_TS4.1), Connectors (J2.4)
-T_1: U_TempSensors/TS1 (R13_TS1.1), Connectors (J1.1)
-T_2: U_TempSensors/TS2 (R13_TS2.1), Connectors (J1.3)
-T_3: U_TempSensors/TS3 (R13_TS3.1), Connectors (J2.1)
-T_4: U_TempSensors/TS4 (R13_TS4.1), Connectors (J2.3)
ALERT 1.ALERT 1: Microcontroller (U1.CN7_4), U_TempSensors/TS1 (IC1_TS1.11)
ALERT 1.ALERT 2: Microcontroller (U1.CN10_15), U_TempSensors/TS1 (IC1_TS1.12)
ALERT 1.ALERT 3: Microcontroller (U1.CN10_13), U_TempSensors/TS1 (IC1_TS1.14)
ALERT 1.ALERT 4: Microcontroller (U1.CN10_1), U_TempSensors/TS1 (IC1_TS1.15)
ALERT 1.ALERT OC: Microcontroller (U1.CN7_3), U_TempSensors/TS1 (IC1_TS1.9)
ALERT 1.ALERT SC: Microcontroller (U1.CN7_2), U_TempSensors/TS1 (IC1_TS1.7)
ALERT 2.ALERT 1: Microcontroller (U1.CN10_6), U_TempSensors/TS2 (IC1_TS2.11)
ALERT 2.ALERT 2: Microcontroller (U1.CN10_19), U_TempSensors/TS2 (IC1_TS2.12)
ALERT 2.ALERT 3: Microcontroller (U1.CN10_16), U_TempSensors/TS2 (IC1_TS2.14)
ALERT 2.ALERT 4: Microcontroller (U1.CN10_17), U_TempSensors/TS2 (IC1_TS2.15)
ALERT 2.ALERT OC: Microcontroller (U1.CN10_4), U_TempSensors/TS2 (IC1_TS2.9)
ALERT 2.ALERT SC: Microcontroller (U1.CN10_2), U_TempSensors/TS2 (IC1_TS2.7)
ALERT 3.ALERT 1: Microcontroller (U1.CN10_14), U_TempSensors/TS3 (IC1_TS3.11)
ALERT 3.ALERT 2: Microcontroller (U1.CN10_22), U_TempSensors/TS3 (IC1_TS3.12)
ALERT 3.ALERT 3: Microcontroller (U1.CN10_21), U_TempSensors/TS3 (IC1_TS3.14)
ALERT 3.ALERT 4: Microcontroller (U1.CN10_24), U_TempSensors/TS3 (IC1_TS3.15)
ALERT 3.ALERT OC: Microcontroller (U1.CN10_11), U_TempSensors/TS3 (IC1_TS3.9)
ALERT 3.ALERT SC: Microcontroller (U1.CN10_12), U_TempSensors/TS3 (IC1_TS3.7)
ALERT 4.ALERT 1: Microcontroller (U1.CN10_30), U_TempSensors/TS4 (IC1_TS4.11)
ALERT 4.ALERT 2: Microcontroller (U1.CN10_29), U_TempSensors/TS4 (IC1_TS4.12)
ALERT 4.ALERT 3: Microcontroller (U1.CN10_34), U_TempSensors/TS4 (IC1_TS4.14)
ALERT 4.ALERT 4: Microcontroller (U1.CN10_33), U_TempSensors/TS4 (IC1_TS4.15)
ALERT 4.ALERT OC: Microcontroller (U1.CN10_28), U_TempSensors/TS4 (IC1_TS4.9)
ALERT 4.ALERT SC: Microcontroller (U1.CN10_26), U_TempSensors/TS4 (IC1_TS4.7)
PR_CTRL_0: Microcontroller (U1.CN10_35), Connectors (B1.1 R15.2)
PR_CTRL_1: Microcontroller (U1.CN10_37), Connectors (B2.1 R18.1)
SCL0: Microcontroller (R9.2 U1.CN10_3), U_TempSensors/TS1 (IC1_TS1.19), U_TempSensors/TS2 (IC1_TS2.19)
SCL1: Microcontroller (R7.2 U1.CN10_23), U_TempSensors/TS3 (IC1_TS3.19), U_TempSensors/TS4 (IC1_TS4.19)
SCL2: Microcontroller (R5.2 U1.CN10_25), Connectors (J5.4)
SDA0: Microcontroller (R8.2 U1.CN10_5), U_TempSensors/TS1 (IC1_TS1.20), U_TempSensors/TS2 (IC1_TS2.20)
SDA1: Microcontroller (R6.2 U1.CN10_27), U_TempSensors/TS3 (IC1_TS3.20), U_TempSensors/TS4 (IC1_TS4.20)
SDA2: Microcontroller (R4.2 U1.CN10_31), Connectors (J5.3)